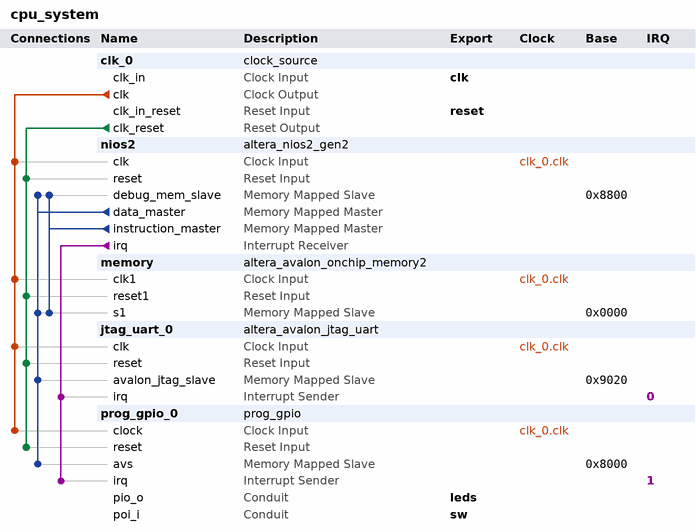
[diagram p0: system contents]
# Platform Designer (Qsys) system cpu_system, Cyclone V 5CSEMA5F31C6
# Parameters at their usual value, and those the tool derives, are not listed.
package require -exact qsys 21.1
create_system cpu_system
set_project_property DEVICE_FAMILY {Cyclone V}
set_project_property DEVICE 5CSEMA5F31C6

add_instance clk_0 clock_source 21.1
set_instance_parameter_value clk_0 clockFrequency 50000000

add_instance nios2 altera_nios2_gen2 21.1
set_instance_parameter_value nios2 dcache_size 2048
set_instance_parameter_value nios2 exceptionSlave memory.s1
set_instance_parameter_value nios2 icache_size 4096
set_instance_parameter_value nios2 impl Tiny
set_instance_parameter_value nios2 resetSlave memory.s1

add_instance memory altera_avalon_onchip_memory2 21.1
set_instance_parameter_value memory dataWidth 32
set_instance_parameter_value memory dualPort false
set_instance_parameter_value memory initMemContent true
set_instance_parameter_value memory initializationFileName onchip_mem.hex
set_instance_parameter_value memory memorySize 20480

add_instance jtag_uart_0 altera_avalon_jtag_uart 21.1
set_instance_parameter_value jtag_uart_0 simInteractiveOptions NO_INTERACTIVE_WINDOWS

add_instance prog_gpio_0 prog_gpio 1.0

# connections
add_connection clk_0.clk jtag_uart_0.clk clock
add_connection clk_0.clk memory.clk1 clock
add_connection clk_0.clk nios2.clk clock
add_connection clk_0.clk prog_gpio_0.clock clock
add_connection clk_0.clk_reset jtag_uart_0.reset reset
add_connection clk_0.clk_reset memory.reset1 reset
add_connection clk_0.clk_reset nios2.reset reset
add_connection clk_0.clk_reset prog_gpio_0.reset reset
add_connection nios2.data_master jtag_uart_0.avalon_jtag_slave avalon
set_connection_parameter_value nios2.data_master/jtag_uart_0.avalon_jtag_slave baseAddress 0x9020
add_connection nios2.data_master memory.s1 avalon
set_connection_parameter_value nios2.data_master/memory.s1 baseAddress 0x0000
add_connection nios2.data_master nios2.debug_mem_slave avalon
set_connection_parameter_value nios2.data_master/nios2.debug_mem_slave baseAddress 0x8800
add_connection nios2.data_master prog_gpio_0.avs avalon
set_connection_parameter_value nios2.data_master/prog_gpio_0.avs baseAddress 0x8000
add_connection nios2.instruction_master memory.s1 avalon
set_connection_parameter_value nios2.instruction_master/memory.s1 baseAddress 0x0000
add_connection nios2.instruction_master nios2.debug_mem_slave avalon
set_connection_parameter_value nios2.instruction_master/nios2.debug_mem_slave baseAddress 0x8800
add_connection nios2.irq jtag_uart_0.irq interrupt
set_connection_parameter_value nios2.irq/jtag_uart_0.irq irqNumber 0
add_connection nios2.irq prog_gpio_0.irq interrupt
set_connection_parameter_value nios2.irq/prog_gpio_0.irq irqNumber 1

# exported interfaces
add_interface clk clock sink
set_interface_property clk EXPORT_OF clk_0.clk_in
add_interface leds conduit end
set_interface_property leds EXPORT_OF prog_gpio_0.pio_o
add_interface reset reset sink
set_interface_property reset EXPORT_OF clk_0.clk_in_reset
add_interface sw conduit end
set_interface_property sw EXPORT_OF prog_gpio_0.poi_i

set_interconnect_requirement {$system} qsys_mm.clockCrossingAdapter HANDSHAKE
set_interconnect_requirement {$system} qsys_mm.enableEccProtection FALSE
set_interconnect_requirement {$system} qsys_mm.insertDefaultSlave FALSE
set_interconnect_requirement {$system} qsys_mm.maxAdditionalLatency 1

save_system cpu_system.qsys
